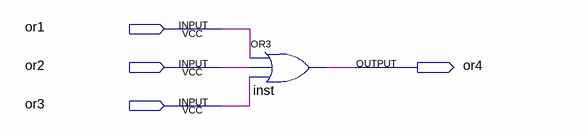
[diagram p0: schematic sheet]
// Quartus schematic pld_ex1_or.bdf as structural Verilog: 1 symbols, 4 pins
module pld_ex1_or (
  input  or1,
  input  or2,
  input  or3,
  output or4
);

  or inst (or4, or1, or2, or3);
endmodule
